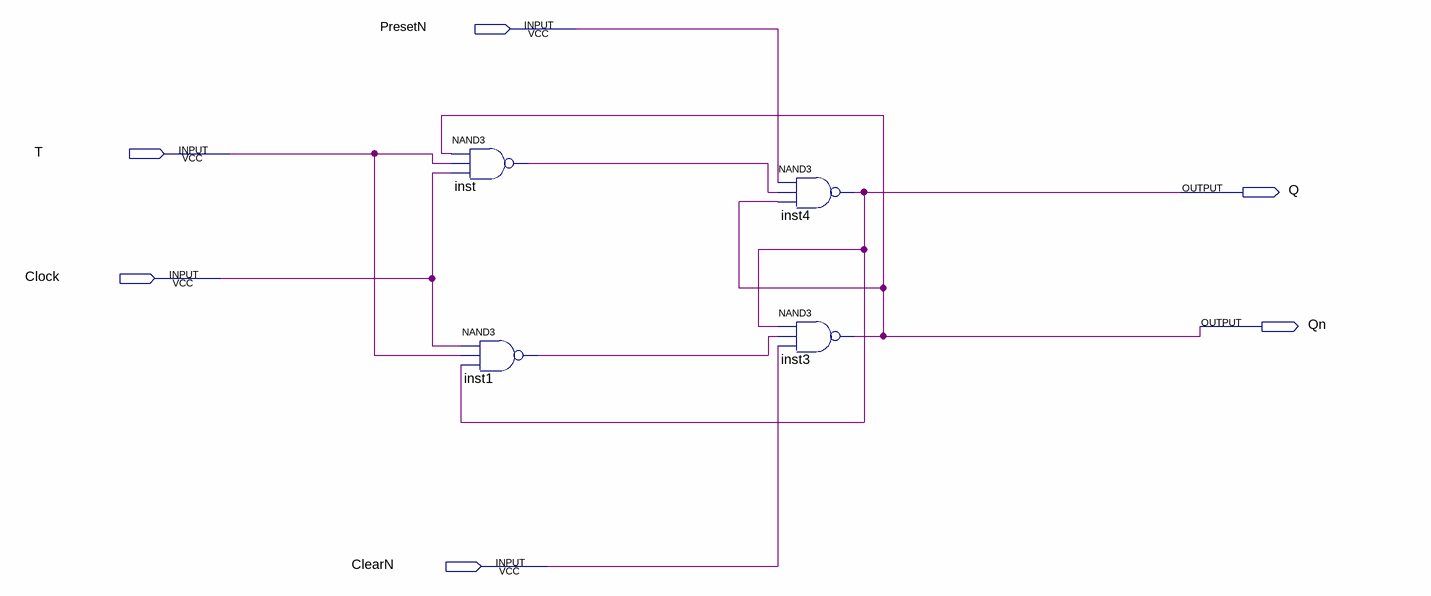
[diagram p0: schematic sheet]
// Quartus schematic TFlipFlop.bdf as structural Verilog: 4 symbols, 6 pins
module TFlipFlop (
  input  PresetN,
  input  T,
  input  Clock,
  input  ClearN,
  output Q,
  output Qn
);

  wire inst1_out, inst_out;

  nand inst (inst_out, Qn, T, Clock);
  nand inst1 (inst1_out, Clock, T, Q);
  nand inst4 (Q, PresetN, inst_out, Qn);
  nand inst3 (Qn, Q, inst1_out, ClearN);
endmodule
